# Altium schematic sheet [05] RTC.SchDoc: Design 1
size Tabloid; Engineer: The ASID Designer; Organization: ASID Designer; Address1: Iran; Address2: Shiraz; Address3: P.O.Box 71765-385; DocumentNumber: 1; Revision: 1.0; SheetNumber: 1; SheetTotal: 1
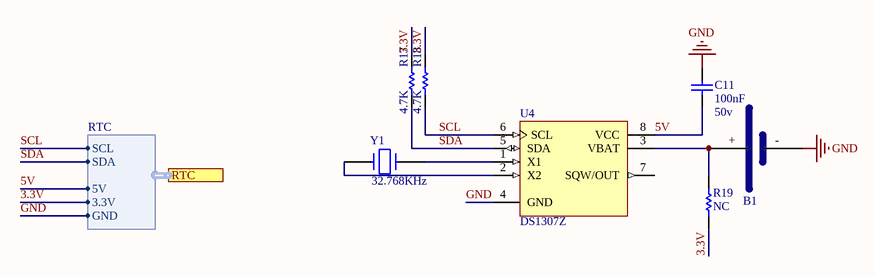
[diagram p0: [05] RTC.SchDoc]

## Parts
B1  Littium Battery  [MY_RTC BAT SMD]  (value not drawn)
C11  Volte: 50v  [MY_0603]  (hidden comment: 100nF)
R17  4.7K  [MY_0603]
R18  4.7K  [MY_0603]
R19  NC  [MY_0805]
U4  DS1307Z  [SOIC8N_N]
Y1  32.768KHz  [MY_RTC_Crystal]

## Ports
RTC (harness RTC)

## Harnesses
RTC: SCL, SDA, 5V, 3.3V, GND

## Nets
GND: B1.- C11.2 U4.4(GND) ; port RTC.GND
3.3V: R17.1 R18.1 R19.2 ; port RTC.3.3V
5V: C11.1 U4.8(VCC) ; port RTC.5V
SCL: R18.2 U4.6(SCL) ; port RTC.SCL
SDA: R17.2 U4.5(SDA) ; port RTC.SDA
NetB1_+: B1.+ R19.1 U4.3(VBAT)
NetU4_1: U4.1(X1) Y1.2
NetU4_2: U4.2(X2) Y1.1

Not connected (* = marked no-connect by the designer): B1 0; U4 7(SQW/OUT)

## Notes on the sheet
- Title
- Engineer:
- Date:
- Ali Asadzadeh
- Time:
- Number:
- Sheet
- Revision:
- of
- www.ASiDesigner.com
- Designed In Shiraz
- ASiD Designer
- File:

## Library data of the parts
B1 = Battery: 3V PC Littium Battery
C11 = Cap ceramic: None polar capacitor; ASiD Part Number: C-AS; Value: 100nF
R17 R18 = Res: Standard resistor; ASiD Part Number: Res-AS; Value: 4.7K
R19 = Res: resistor 1/4 wat; Value: NC
U4 = DS1307Z: 64 X 8 Serial Real-Time Clock; Published: 13-Oct-2000; LatestRevisionDate: 13-Apr-2006; LatestRevisionNote: IPC-7351 Footprint Added.; DatasheetVersion: 10-Aug-1999; PackageVersion: 1999; PackageReference: SOIC8N; Publisher: Altium Limited; PackageDescription: 8-Pin Small Outline Integrated Circuit 1.27 mm Pitch; Code_IPC: SOIC127P600-8; ComponentLink1Description: Manufacturer Link; ComponentLink1URL: http://www.maxim-ic.com/; ComponentLink2Description: Datasheet; ComponentLink2URL: http://pdfserv.maxim-ic.com/en/ds/DS1307.pdf; ComponentLink3Description: Discontinuation Notice; ComponentLink3URL: http://www.maxim-ic.com/qa/pdfs/non-obsolescence-letter.pdf
Y1 = CRYSTAL: ASiD Part Number: Crystal-AS